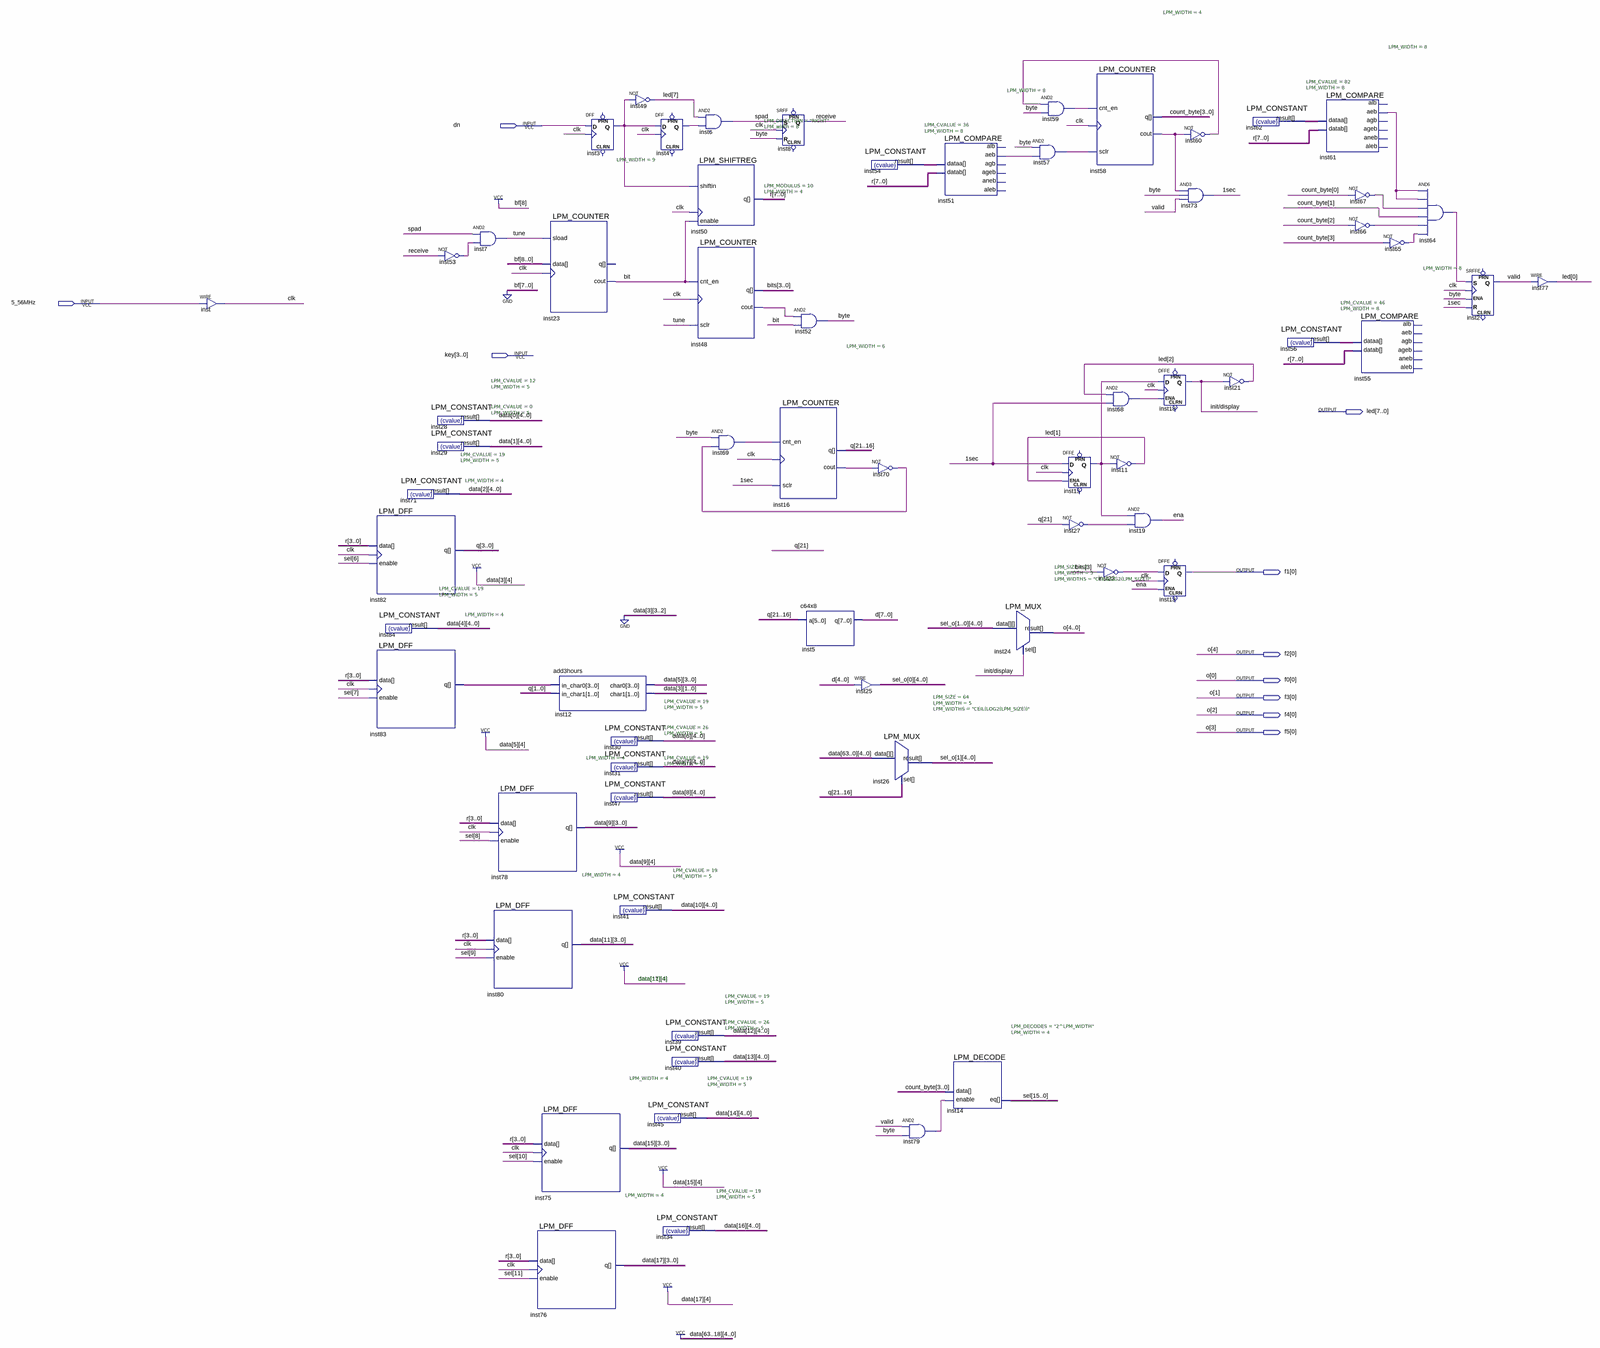
[diagram p0: schematic sheet, whole]
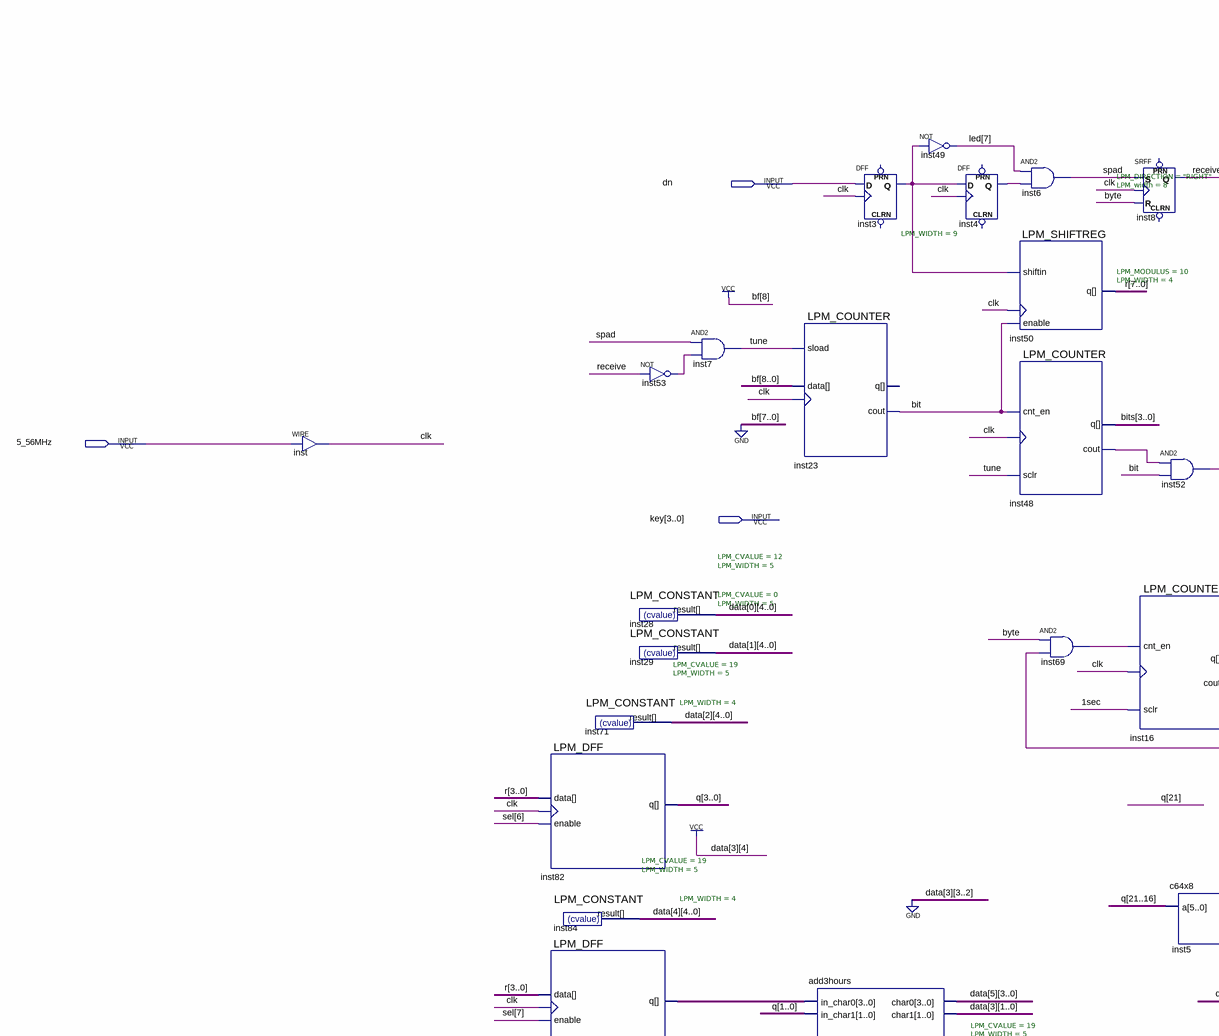
[diagram p1: schematic sheet, upper left part]
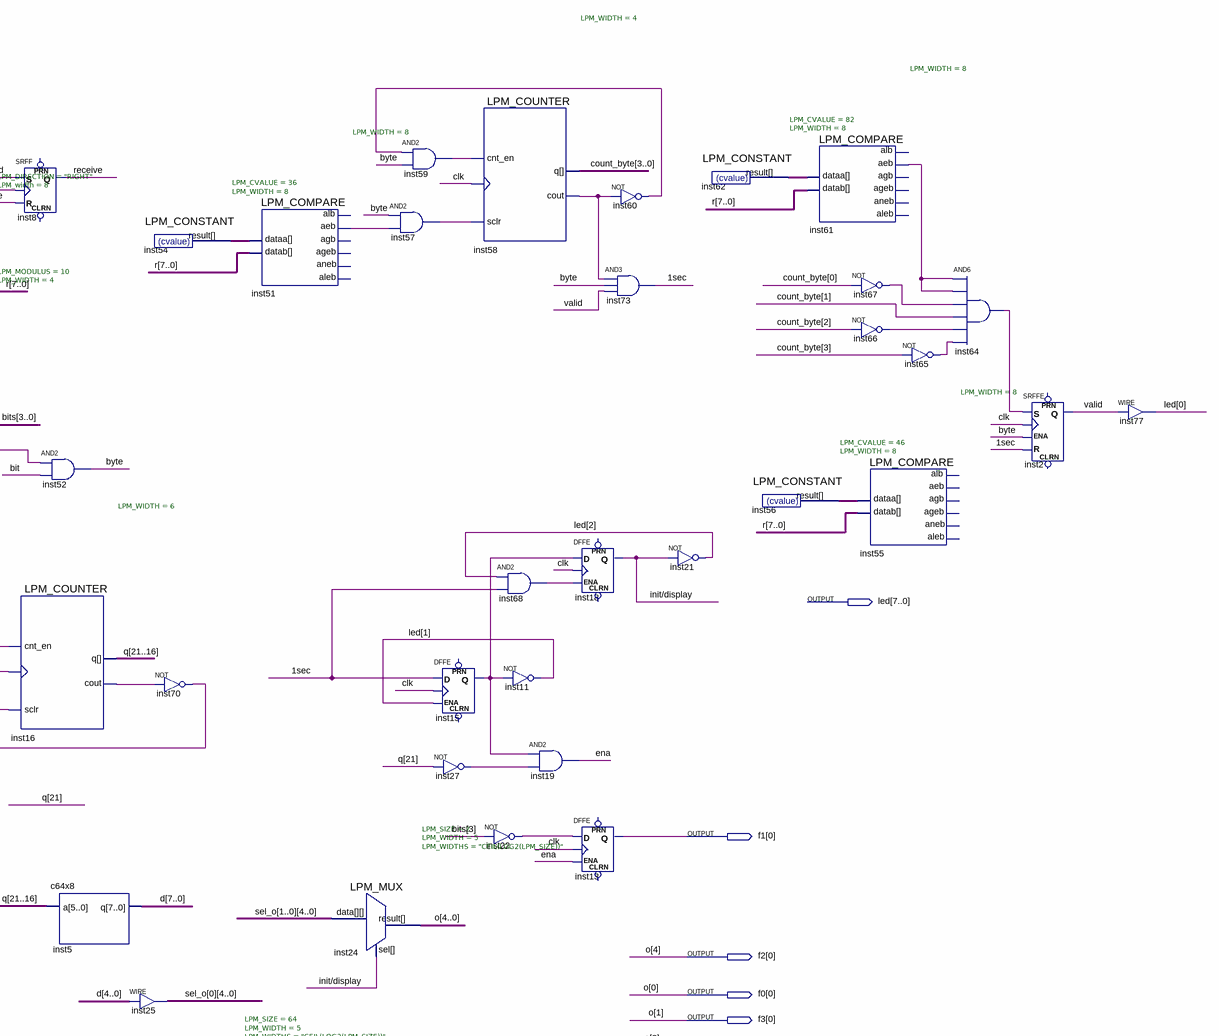
[diagram p2: schematic sheet, upper right part]
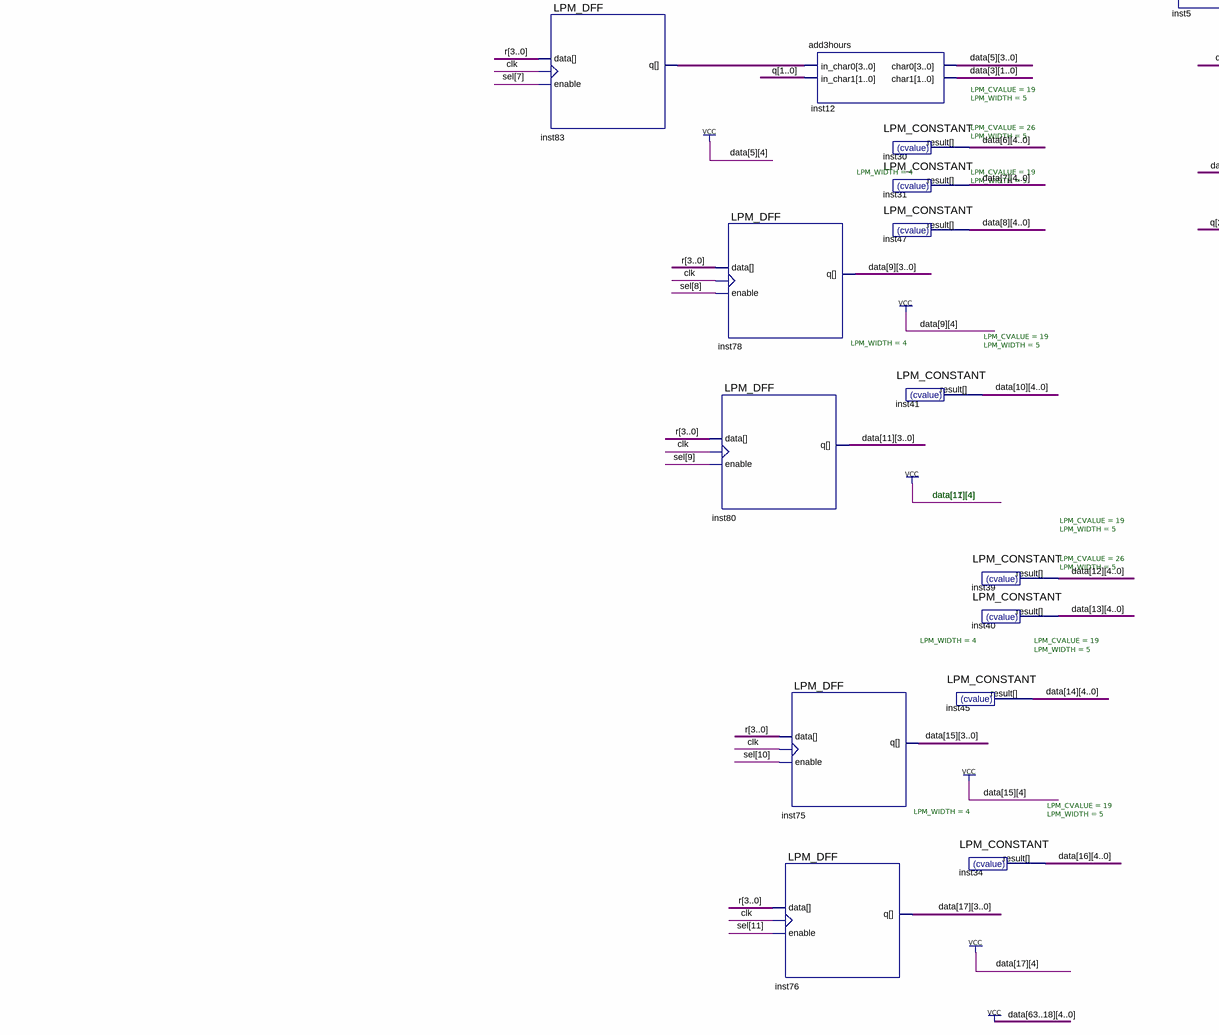
[diagram p3: schematic sheet, lower left part]
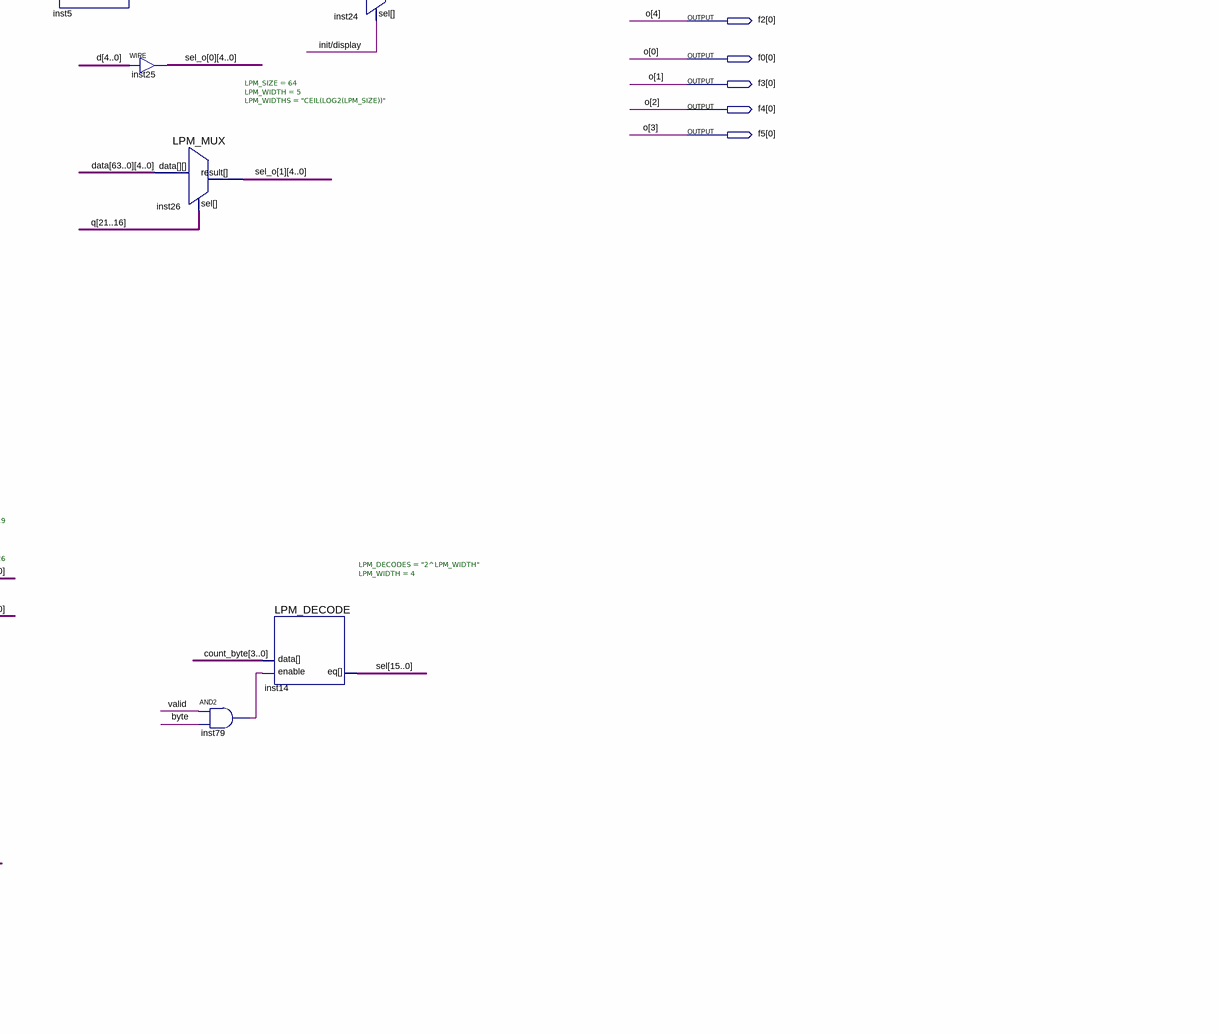
[diagram p4: schematic sheet, lower right part]
// Quartus schematic max2.bdf as structural Verilog: 66 symbols, 10 pins
module max2 (
  input  dn,
  input  \5_56MHz ,
  input  [3:0] key,
  output [7:0] led,
  output [0:0] f1,
  output [0:0] f2,
  output [0:0] f0,
  output [0:0] f3,
  output [0:0] f4,
  output [0:0] f5
);

  wire \1sec , \bit , \byte , clk, ena, \init/display , inst3_q, inst4_q, inst15_q, inst16_cout, inst22_out,
       inst27_out, inst48_cout, inst51_aeb, inst53_out, inst57_out, inst58_cout, inst59_out, inst60_out,
       inst61_aeb, inst64_out, inst65_out, inst66_out, inst67_out, inst68_out, inst69_out, inst70_out,
       inst79_out, receive, spad, tune, valid;
  wire [1:0] data_3;
  wire [3:0] bits, count_byte, data_5, data_9, data_11, data_15, data_17, inst83_q;
  wire [4:0] data_0, data_1, data_2, data_4, data_6, data_7, data_8, data_10, data_12, data_13, data_14,
       data_16, sel_o_0, sel_o_1;
  wire [7:0] d, inst54_result, inst56_result, inst62_result, r;
  wire [15:0] sel;
  wire [21:0] q;

  assign clk = \5_56MHz ;  // WIRE inst
  LPM_DFF #(.LPM_WIDTH(4)) inst82 (.enable(sel[6]), .clock(clk), .data(r[3:0]), .q(q[3:0]));
  LPM_CONSTANT #(.LPM_CVALUE(19), .LPM_WIDTH(5)) inst84 (.result(data_4));
  LPM_DFF #(.LPM_WIDTH(4)) inst83 (.enable(sel[7]), .clock(clk), .data(r[3:0]), .q(inst83_q));
  LPM_CONSTANT #(.LPM_CVALUE(19), .LPM_WIDTH(5)) inst71 (.result(data_2));
  not inst53 (inst53_out, receive);
  LPM_CONSTANT #(.LPM_CVALUE(12), .LPM_WIDTH(5)) inst28 (.result(data_0));
  LPM_CONSTANT #(.LPM_CVALUE(0), .LPM_WIDTH(5)) inst29 (.result(data_1));
  and inst7 (tune, spad, inst53_out);
  LPM_DFF #(.LPM_WIDTH(4)) inst78 (.enable(sel[8]), .clock(clk), .data(r[3:0]), .q(data_9));
  LPM_DFF #(.LPM_WIDTH(4)) inst80 (.enable(sel[9]), .clock(clk), .data(r[3:0]), .q(data_11));
  LPM_DFF #(.LPM_WIDTH(4)) inst76 (.enable(sel[11]), .clock(clk), .data(r[3:0]), .q(data_17));
  LPM_COUNTER #(.LPM_WIDTH(9)) inst23 (.sload(tune), .data(9'b100000000), .clock(clk), .cout(\bit ));  // open: q
  add3hours inst12 (.in_char0(inst83_q), .in_char1(q[1:0]), .char0(data_5), .char1(data_3));
  LPM_DFF #(.LPM_WIDTH(4)) inst75 (.enable(sel[10]), .clock(clk), .data(r[3:0]), .q(data_15));
  DFF inst3 (.CLK(clk), .D(dn), .Q(inst3_q));  // open: CLRN, PRN
  not inst49 (led[7], inst3_q);
  LPM_CONSTANT #(.LPM_CVALUE(19), .LPM_WIDTH(5)) inst30 (.result(data_6));
  LPM_CONSTANT #(.LPM_CVALUE(26), .LPM_WIDTH(5)) inst31 (.result(data_7));
  LPM_CONSTANT #(.LPM_CVALUE(19), .LPM_WIDTH(5)) inst47 (.result(data_8));
  LPM_CONSTANT #(.LPM_CVALUE(19), .LPM_WIDTH(5)) inst41 (.result(data_10));
  DFF inst4 (.CLK(clk), .D(inst3_q), .Q(inst4_q));  // open: CLRN, PRN
  LPM_CONSTANT #(.LPM_CVALUE(19), .LPM_WIDTH(5)) inst39 (.result(data_12));
  LPM_CONSTANT #(.LPM_CVALUE(26), .LPM_WIDTH(5)) inst40 (.result(data_13));
  LPM_CONSTANT #(.LPM_CVALUE(19), .LPM_WIDTH(5)) inst45 (.result(data_14));
  LPM_CONSTANT #(.LPM_CVALUE(19), .LPM_WIDTH(5)) inst34 (.result(data_16));
  and inst6 (spad, led[7], inst4_q);
  LPM_SHIFTREG #(.LPM_DIRECTION("RIGHT"), .LPM_width(8)) inst50 (.shiftin(inst3_q), .enable(\bit ), .clock(clk), .q(r));
  LPM_COUNTER #(.LPM_MODULUS(10), .LPM_WIDTH(4)) inst48 (
    .cnt_en(\bit ), .clock(clk), .sclr(tune), .q(bits), .cout(inst48_cout));
  and inst69 (inst69_out, \byte , inst70_out);
  LPM_COUNTER #(.LPM_WIDTH(6)) inst16 (
    .cnt_en(inst69_out), .clock(clk), .sclr(\1sec ), .q(q[21:16]), .cout(inst16_cout));
  SRFF inst8 (.S(spad), .R(\byte ), .CLK(clk), .Q(receive));  // open: PRN, CLRN
  and inst52 (\byte , inst48_cout, \bit );
  c64x8 inst5 (.a(q[21:16]), .q(d));
  LPM_CONSTANT #(.LPM_CVALUE(36), .LPM_WIDTH(8)) inst54 (.result(inst54_result));
  not inst70 (inst70_out, inst16_cout);
  assign sel_o_0 = d[4:0];  // WIRE inst25
  LPM_MUX #(.LPM_SIZE(64), .LPM_WIDTH(5), .LPM_WIDTHS("CEIL(LOG2(LPM_SIZE))")) inst26 (
    .data({{231{1'b1}}, data_17, data_16, 1'b1, data_15, data_14, data_13, data_12, 1'b1, data_11, data_10, 1'b1, data_9, data_8, data_7, data_6, 1'b1, data_5, data_4, 3'b100, data_3, data_2, data_1, data_0}),
    .sel(q[21:16]), .result(sel_o_1));
  and inst79 (inst79_out, valid, \byte );
  LPM_COMPARE #(.LPM_WIDTH(8)) inst51 (
    .dataa(inst54_result), .datab(r), .aeb(inst51_aeb));  // open: aleb, agb, aneb, ageb, alb
  LPM_DECODE #(.LPM_DECODES("2^LPM_WIDTH"), .LPM_WIDTH(4)) inst14 (.enable(inst79_out), .data(count_byte), .eq(sel));
  LPM_MUX #(.LPM_SIZE(2), .LPM_WIDTH(5), .LPM_WIDTHS("CEIL(LOG2(LPM_SIZE))")) inst24 (
    .data({sel_o_1, sel_o_0}), .sel(\init/display ), .result({f2[0], f5[0], f4[0], f3[0], f0[0]}));
  and inst59 (inst59_out, inst60_out, \byte );
  and inst57 (inst57_out, \byte , inst51_aeb);
  DFFE inst15 (.D(\1sec ), .CLK(clk), .ENA(led[1]), .Q(inst15_q));  // open: PRN, CLRN
  not inst27 (inst27_out, q[21]);
  LPM_COUNTER #(.LPM_WIDTH(4)) inst58 (
    .cnt_en(inst59_out), .clock(clk), .sclr(inst57_out), .q(count_byte), .cout(inst58_cout));
  and inst68 (inst68_out, led[2], \1sec );
  not inst11 (led[1], inst15_q);
  not inst22 (inst22_out, bits[3]);
  and inst19 (ena, inst15_q, inst27_out);
  not inst60 (inst60_out, inst58_cout);
  and inst73 (\1sec , inst58_cout, \byte , valid);
  DFFE inst18 (.D(inst15_q), .CLK(clk), .ENA(inst68_out), .Q(\init/display ));  // open: PRN, CLRN
  DFFE inst13 (.D(inst22_out), .CLK(clk), .ENA(ena), .Q(f1[0]));  // open: PRN, CLRN
  not inst21 (led[2], \init/display );
  LPM_CONSTANT #(.LPM_CVALUE(82), .LPM_WIDTH(8)) inst62 (.result(inst62_result));
  LPM_CONSTANT #(.LPM_CVALUE(46), .LPM_WIDTH(8)) inst56 (.result(inst56_result));
  LPM_COMPARE #(.LPM_WIDTH(8)) inst61 (
    .dataa(inst62_result), .datab(r), .aeb(inst61_aeb));  // open: aleb, agb, aneb, ageb, alb
  not inst67 (inst67_out, count_byte[0]);
  not inst66 (inst66_out, count_byte[2]);
  LPM_COMPARE #(.LPM_WIDTH(8)) inst55 (.dataa(inst56_result), .datab(r));  // open: aleb, aeb, agb, aneb, ageb, alb
  not inst65 (inst65_out, count_byte[3]);
  and inst64 (inst64_out, inst61_aeb, inst61_aeb, inst67_out, count_byte[1], inst66_out, inst65_out);
  SRFFE inst2 (.S(inst64_out), .CLK(clk), .R(\1sec ), .ENA(\byte ), .Q(valid));  // open: PRN, CLRN
  assign led[0] = valid;  // WIRE inst77

  // Other names for the same wires on the sheet: o[4:0] = {f2[0], f5[0], f4[0], f3[0], f0[0]}

  // Notes on the sheet:
  //   data[17][4]
endmodule
